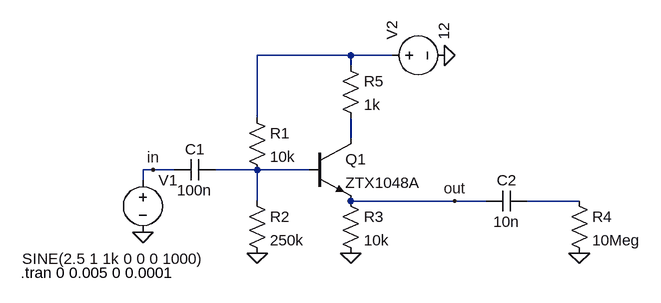
[diagram p0: schematic OB_npn_amp_1.asc]
OB_npn_amp_1.asc, the LTspice schematic file:
Version 4
SHEET 1 880 680
WIRE 320 -128 176 -128
WIRE 384 -128 320 -128
WIRE 320 -112 320 -128
WIRE 176 -32 176 -128
WIRE 320 0 320 -32
WIRE 16 48 0 48
WIRE 48 48 16 48
WIRE 176 48 112 48
WIRE 256 48 176 48
WIRE 0 64 0 48
WIRE 176 96 176 48
WIRE 480 96 320 96
WIRE 528 96 480 96
WIRE 672 96 592 96
FLAG 176 176 0
FLAG 320 176 0
FLAG 0 144 0
FLAG 464 -128 0
FLAG 672 176 0
FLAG 480 96 out
FLAG 16 48 in
SYMBOL voltage 0 48 R0
WINDOW 3 -186 137 Left 2
WINDOW 123 0 0 Left 0
WINDOW 39 0 0 Left 0
SYMATTR InstName V1
SYMATTR Value SINE(2.5 1 1k 0 0 0 1000)
SYMBOL voltage 368 -128 R270
WINDOW 123 0 0 Left 0
WINDOW 39 0 0 Left 0
SYMATTR InstName V2
SYMATTR Value 12
SYMBOL npn 256 0 R0
SYMATTR InstName Q1
SYMATTR Value ZTX1048A
SYMBOL cap 112 32 R90
WINDOW 0 0 32 VBottom 2
WINDOW 3 32 32 VTop 2
SYMATTR InstName C1
SYMATTR Value 100n
SYMBOL res 160 -48 R0
SYMATTR InstName R1
SYMATTR Value 10k
SYMBOL res 160 80 R0
SYMATTR InstName R2
SYMATTR Value 250k
SYMBOL res 304 80 R0
SYMATTR InstName R3
SYMATTR Value 10k
SYMBOL res 656 80 R0
SYMATTR InstName R4
SYMATTR Value 10Meg
SYMBOL cap 592 80 R90
WINDOW 0 0 32 VBottom 2
WINDOW 3 32 32 VTop 2
SYMATTR InstName C2
SYMATTR Value 10n
SYMBOL res 304 -128 R0
SYMATTR InstName R5
SYMATTR Value 1k
TEXT -188 206 Left 2 !.tran 0 0.005 0 0.0001

The netlist it stands for:
* OB_npn_amp_1.asc
V1 in 0 SINE(2.5 1 1k 0 0 0 1000)
V2 N001 0 12
Q1 N002 N003 out 0 ZTX1048A
C1 N003 in 100n
R1 N001 N003 10k
R2 N003 0 250k
R3 out 0 10k
R4 N004 0 10Meg
C2 N004 out 10n
R5 N001 N002 1k
.model NPN NPN
.model PNP PNP
.lib standard.bjt
.tran 0 0.005 0 0.0001
.backanno
.end